# EAGLE design Schutz (EAGLE 6.2)
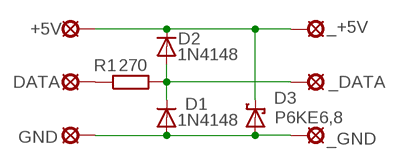
[diagram p0: schematic, sheet 1]

## Parts
+5V  LSP11  [LSP11]
_+5V  LSP11  [LSP11]
_DATA  LSP11  [LSP11]
_GND  LSP11  [LSP11]
D1  1N4148  1N4148DO35-7  [DO35-7]
D2  1N4148  1N4148DO35-7  [DO35-7]
D3  P6KE6,8  P6KEXX  [CB417-15]
DATA  LSP11  [LSP11]
GND  LSP11  [LSP11]
R1  270  R-EU_0207/7  [0207/7]

## Nets
N$1: _DATA.MP D1.C D2.A R1.2
N$2: _GND.MP D1.A D3.A GND.MP
N$3: +5V.MP _+5V.MP D2.C D3.C
N$4: DATA.MP R1.1

## Library data of the parts
+5V _+5V _DATA _GND DATA GND = solpad:LSP11: SOLDER PAD drill 1.1 mm
D1 D2 = diode:1N4148: DIODE high speed (Philips)
D3 = diode:P6KEXX: DIODE transient-voltage suppressor
R1 = resistor:R-EU_: RESISTOR, European symbol

## Board
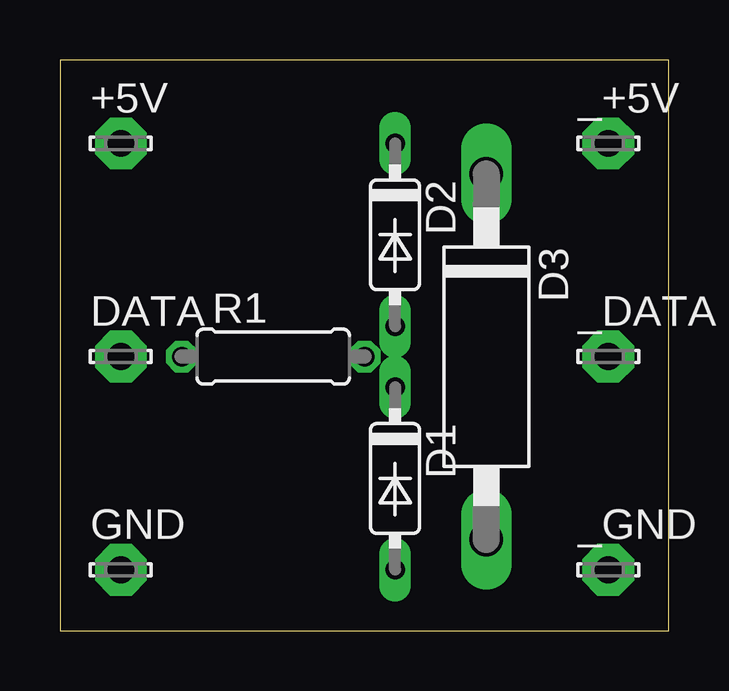
[diagram p1: board, top side]
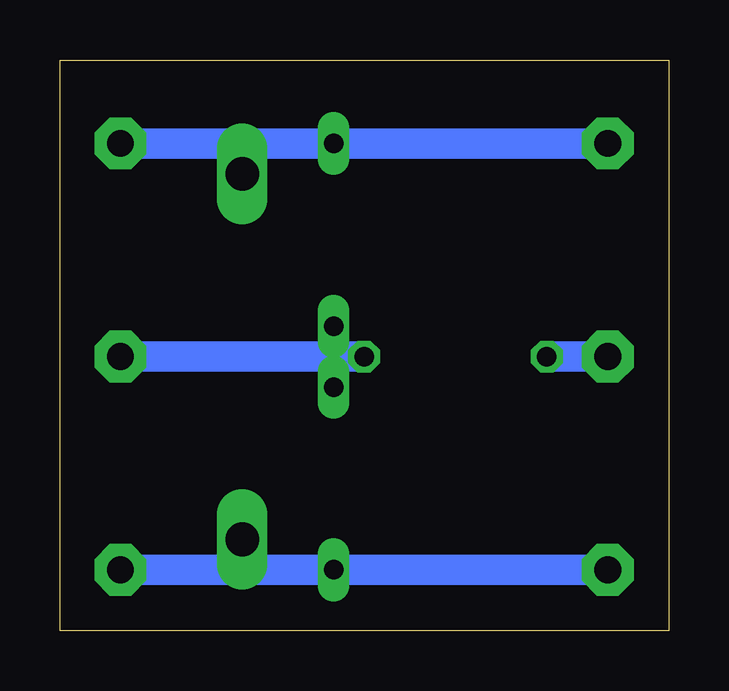
[diagram p2: board, bottom side, seen from below]

Size 25.38 x 23.8 mm. Coordinates in mm from the lower left corner, seen from the top.
Outline: 0,0 25.38,0 25.38,23.8 0,23.8 0,0
Copper layers (1*16): Top 0.035mm / dielectric 1.5mm / Bottom 0.035mm
Design rules: minimum track width 10mil, minimum drill 24mil, track to track 8mil, track to pad 8mil, pad to pad 8mil, via to via 8mil, smd to smd 8mil, copper to edge 40mil, drill to drill 8mil, minimum pad ring 10mil, minimum via ring 8mil, stop-mask expansion 4mil, vias tented up to drill 0mil, thermal gap 10mil

### Footprints (pad centres in the part's own frame; a part is rotated, then mirrored left to right if it is on the bottom)
LSP11 = drill 1.118 pad 2.159 octagon: MP 0,0
DO35-7 = drill 0.813 long: A 3.81,0; C -3.81,0
CB417-15 = drill 1.397 long: A 7.62,0; C -7.62,0
0207/7 = drill 0.813 octagon: 1 -3.81,0; 2 3.81,0

### Placement (x,y rotation side)
+5V  2.54,20.32 0 top
_+5V  22.86,20.32 0 top
_DATA  22.86,11.43 0 top
_GND  22.86,2.54 0 top
D1  13.97,6.35 270 top
D2  13.97,16.51 270 top
D3  17.78,11.43 270 top
DATA  2.54,11.43 0 top
GND  2.54,2.54 0 top
R1  8.89,11.43 0 top

### Tracks (layer width: path | path; a pad name or v marks a point on that pad's centre or on a via)
N$1
  Bottom 1.27: R1.2 13.97,11.43 | 13.97,11.43 17.78,11.43 _DATA.MP | D2.A 13.97,11.43 | D1.C 13.97,11.43
N$2
  Bottom 1.27: GND.MP D1.A 17.78,2.54 | 17.78,2.54 D3.A | _GND.MP 17.78,2.54
N$3
  Bottom 1.27: +5V.MP D2.C 17.78,20.32 | 17.78,20.32 D3.C 17.78,20.32 | _+5V.MP 17.78,20.32
N$4
  Bottom 1.27: DATA.MP R1.1